# Altium schematic sheet 05_Display.SchDoc
size A4; SheetNumber: 5; SheetTotal: 6
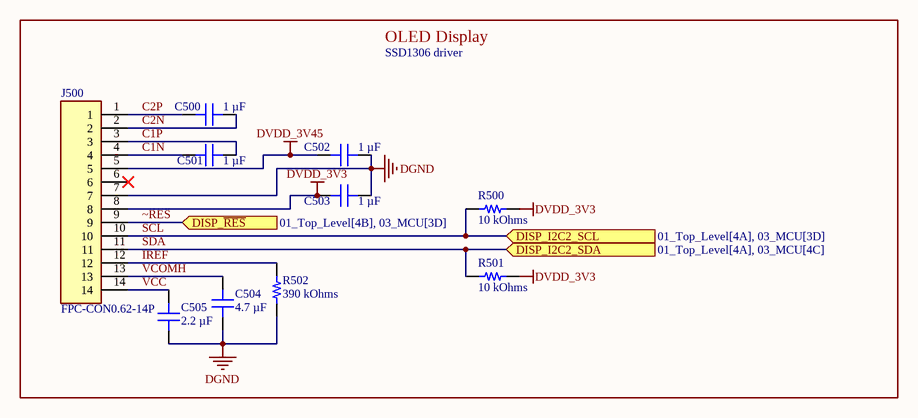
[diagram p0: 05_Display.SchDoc]

## Parts
C500  1 µF  [CAP 0603_1608]
C501  1 µF  [CAP 0603_1608]
C502  1 µF  [CAP 0603_1608]
C503  1 µF  [CAP 0603_1608]
C504  4.7 µF  [CAP 0805_2012]
C505  2.2 µF  [CAP 0603_1608]
J500  FPC-CON0.62-14P  [FPC-CON0.62-14P]  (no BOM)
R500  10 kOhms  [RES 0402_1005]
R501  10 kOhms  [RES 0402_1005]
R502  390 kOhms  [RES 0402_1005]

## Ports
DISP_I2C2_SCL (in, see 01_Top_Level[4A], 03_MCU[3D]), DISP_I2C2_SDA (in, see 01_Top_Level[4A], 03_MCU[4C]), DISP_~{RES} (in, see 01_Top_Level[4B], 03_MCU[3D])

## Nets
DGND: C502.2 C503.2 C504.1 C505.2 J500.7 R502.1
DVDD_3V3: C503.1 J500.8 R500.1 R501.1
DVDD_3V45: C502.1 J500.5
C1N: C501.1 J500.4
C1P: C501.2 J500.3
C2N: C500.2 J500.2
C2P: C500.1 J500.1
IREF: J500.12 R502.2
SCL: J500.10 R500.2 ; port DISP_I2C2_SCL
SDA: J500.11 R501.2 ; port DISP_I2C2_SDA
VCC: C505.1 J500.14
VCOMH: C504.2 J500.13
~RES: J500.9 ; port DISP_~{RES}

Not connected (* = marked no-connect by the designer): J500 6*

## Notes on the sheet
- OLED Display
- SSD1306 driver

## Library data of the parts
C500-C503 = CL10A105KA8NFNC: CAP CER 1UF 25V X5R 0603; manufacturer: Samsung Electro-Mechanics; Tolerance: ±10%; Part Number: CL10A105KA8NFNC; Capacitance: 1 µF; Applications: General Purpose; componentlink1description: Datasheet; componentlink1url: http://www.samsungsem.com/kr/support/product-search/mlcc/CL10A105KA8NFNC.jsp; componentlink2description: DigiKey Link; componentlink2url: https://www.digikey.com/en/products/detail/samsung-electro-mechanics/CL10A105KA8NFNC/3887517; Device Package: 0603 (1608 Metric); lastupdated: 4/6/2026 7:23:08 PM; Lifecycle Status: Active; Minimum Order: 1; Mounting Type: Surface Mount, MLCC; Operating Temperature: -55°C ~ 85°C; Package / Case: 0603 (1608 Metric); packaging: TapeAndReel; partid: 14268; Part Status: Active; price: 0.01; series: CL; Size / Dimension: 0.063" L x 0.031" W (1.60mm x 0.80mm); Supplier 1: DigiKey; Supplier Part Number 1: 1276-1859-1-ND; Temperature Coefficient: X5R; Thickness (Max): 0.035" (0.90mm); value: 1 µF; Voltage - Rated: 25V
C504 = MSAST21GAB5475KTNA01: CAP CER 4.7UF 25V X5R 0805; manufacturer: Taiyo Yuden; Tolerance: ±10%; Part Number: MSAST21GAB5475KTNA01; Capacitance: 4.7 µF; Applications: SMPS Filtering; componentlink1description: Datasheet; componentlink1url: https://mm.digikey.com/Volume0/opasdata/d220001/medias/docus/5731/MSR01_e.pdf; componentlink2description: DigiKey Link; componentlink2url: https://www.digikey.com/en/products/detail/taiyo-yuden/MSAST21GAB5475KTNA01/16659772; Device Package: 0805 (2012 Metric); lastupdated: 4/6/2026 7:29:35 PM; Lifecycle Status: Active; Minimum Order: 1; Mounting Type: Surface Mount, MLCC; Operating Temperature: -55°C ~ 85°C; Package / Case: 0805 (2012 Metric); packaging: TapeAndReel; partid: 73602; price: 0.02; series: MSAS; Size / Dimension: 0.079" L x 0.049" W (2.00mm x 1.25mm); Supplier 1: DigiKey; Supplier Part Number 1: 587-MSAST21GAB5475KTNA01CT-ND; Temperature Coefficient: X5R; Thickness (Max): 0.055" (1.40mm); value: 4.7 µF; Voltage - Rated: 25V
C505 = GRM188R61E225KA12D: CAP CER 2.2UF 25V X5R 0603; manufacturer: Murata Electronics; Tolerance: ±10%; Part Number: GRM188R61E225KA12D; Capacitance: 2.2 µF; Applications: General Purpose; componentlink1description: Datasheet; componentlink1url: https://search.murata.co.jp/Ceramy/image/img/A01X/G101/ENG/GRM188R61E225KA12-01.pdf; componentlink2description: DigiKey Link; componentlink2url: https://www.digikey.com/en/products/detail/murata-electronics/GRM188R61E225KA12D/4905349; Device Package: 0603 (1608 Metric); lastupdated: 4/6/2026 7:23:52 PM; Lifecycle Status: Active; Minimum Order: 1; Mounting Type: Surface Mount, MLCC; Operating Temperature: -55°C ~ 85°C; Package / Case: 0603 (1608 Metric); packaging: TapeAndReel; partid: 2326; Part Status: Active; price: 0.01; series: GRM; Size / Dimension: 0.063" L x 0.031" W (1.60mm x 0.80mm); Supplier 1: DigiKey; Supplier Part Number 1: 490-10731-1-ND; Temperature Coefficient: X5R; Thickness (Max): 0.035" (0.90mm); value: 2.2 µF; Voltage - Rated: 25V
J500 = FPC-CON0.62-14P: FPC Connector 14 Pin 0.62mm Pitch; OLED Display Interfacing Document: https://www.buydisplay.com/download/interfacing/ER-OLED0.69-1_Interfacing.pdf; SSD1306B Datasheet: https://www.buydisplay.com/download/ic/SSD1306.pdf
R500 R501 = CRCW040210K0FKEE: RES SMD 10K OHM 1% 1/16W 0402; Manufacturer: Vishay Dale; Power (Watts): 0.063W, 1/16W; Temperature Coefficient: ±100ppm/°C; Part Number: CRCW040210K0FKEE; Value: 10 kOhms; ComponentLink1Description: Datasheet; ComponentLink1URL: http://www.vishay.com/docs/20035/dcrcwe3.pdf; ComponentLink2Description: DigiKey Link; ComponentLink2URL: https://www.digikey.com/en/products/detail/vishay-dale/CRCW040210K0FKEE/5069897; Composition: Thick Film; Device Package: 0402 (1005 Metric); Features: Automotive AEC-Q200; Height - Seated (Max): 0.016" (0.40mm); LastUpdated: 2/9/2024 8:30:20 PM; Lifecycle Status: Active; Minimum Order: 1; Number of Terminations: 2; Operating Temperature: -55°C ~ 155°C; Package / Case: 0402 (1005 Metric); Packaging: CutTape; PartId: 3471; Part Status: Active; Price: 0.01; Ratings: AEC-Q200; Resistance: 10 kOhms; Series: CRCW; Size / Dimension: 0.039" L x 0.020" W (1.00mm x 0.50mm); Supplier 1: DigiKey; Supplier Part Number 1: 541-2954-1-ND; Supplier Device Package: 0402; Tolerance: ±1%
R502 = CRGCQ0402F390K: RES 390K OHM 1% 1/16W 0402; Manufacturer: TE Connectivity Passive Product; Power (Watts): 0.063W, 1/16W; Temperature Coefficient: ±100ppm/°C; Part Number: CRGCQ0402F390K; Value: 390 kOhms; ComponentLink1Description: Datasheet; ComponentLink1URL: https://www.te.com/commerce/DocumentDelivery/DDEController?Action=srchrtrv&DocNm=1773204-3&DocType=DS&DocLang=English; ComponentLink2Description: DigiKey Link; ComponentLink2URL: https://www.digikey.com/en/products/detail/te-connectivity-passive-product/CRGCQ0402F390K/8576260; Composition: Thick Film; Device Package: 0402 (1005 Metric); Features: Automotive AEC-Q200, Moisture Resistant; Height - Seated (Max): 0.016" (0.40mm); LastUpdated: 2/9/2024 8:30:02 PM; Lifecycle Status: Active; Minimum Order: 1; Number of Terminations: 2; Operating Temperature: -55°C ~ 155°C; Package / Case: 0402 (1005 Metric); Packaging: CutTape; PartId: 8107; Part Status: Active; Price: 0.01; Ratings: AEC-Q200; Resistance: 390 kOhms; Series: CRGCQ; Size / Dimension: 0.039" L x 0.020" W (1.00mm x 0.50mm); Supplier 1: DigiKey; Supplier Part Number 1: A129658CT-ND; Supplier Device Package: 0402; Tolerance: ±1%